# EasyEDA Pro project ProPrj_Y车Y形板_2025-09-30.epro, schematic 转线板
Board Name: ART屏幕接线板; Create Date: 2025-05-24; Page Name: P1; Project Name: Y车Y形板; Schematic Name: 转线板; Update Date: 2025-05-31; Company: 嘉立创EDA; Page Size: A4; Version: V1.0
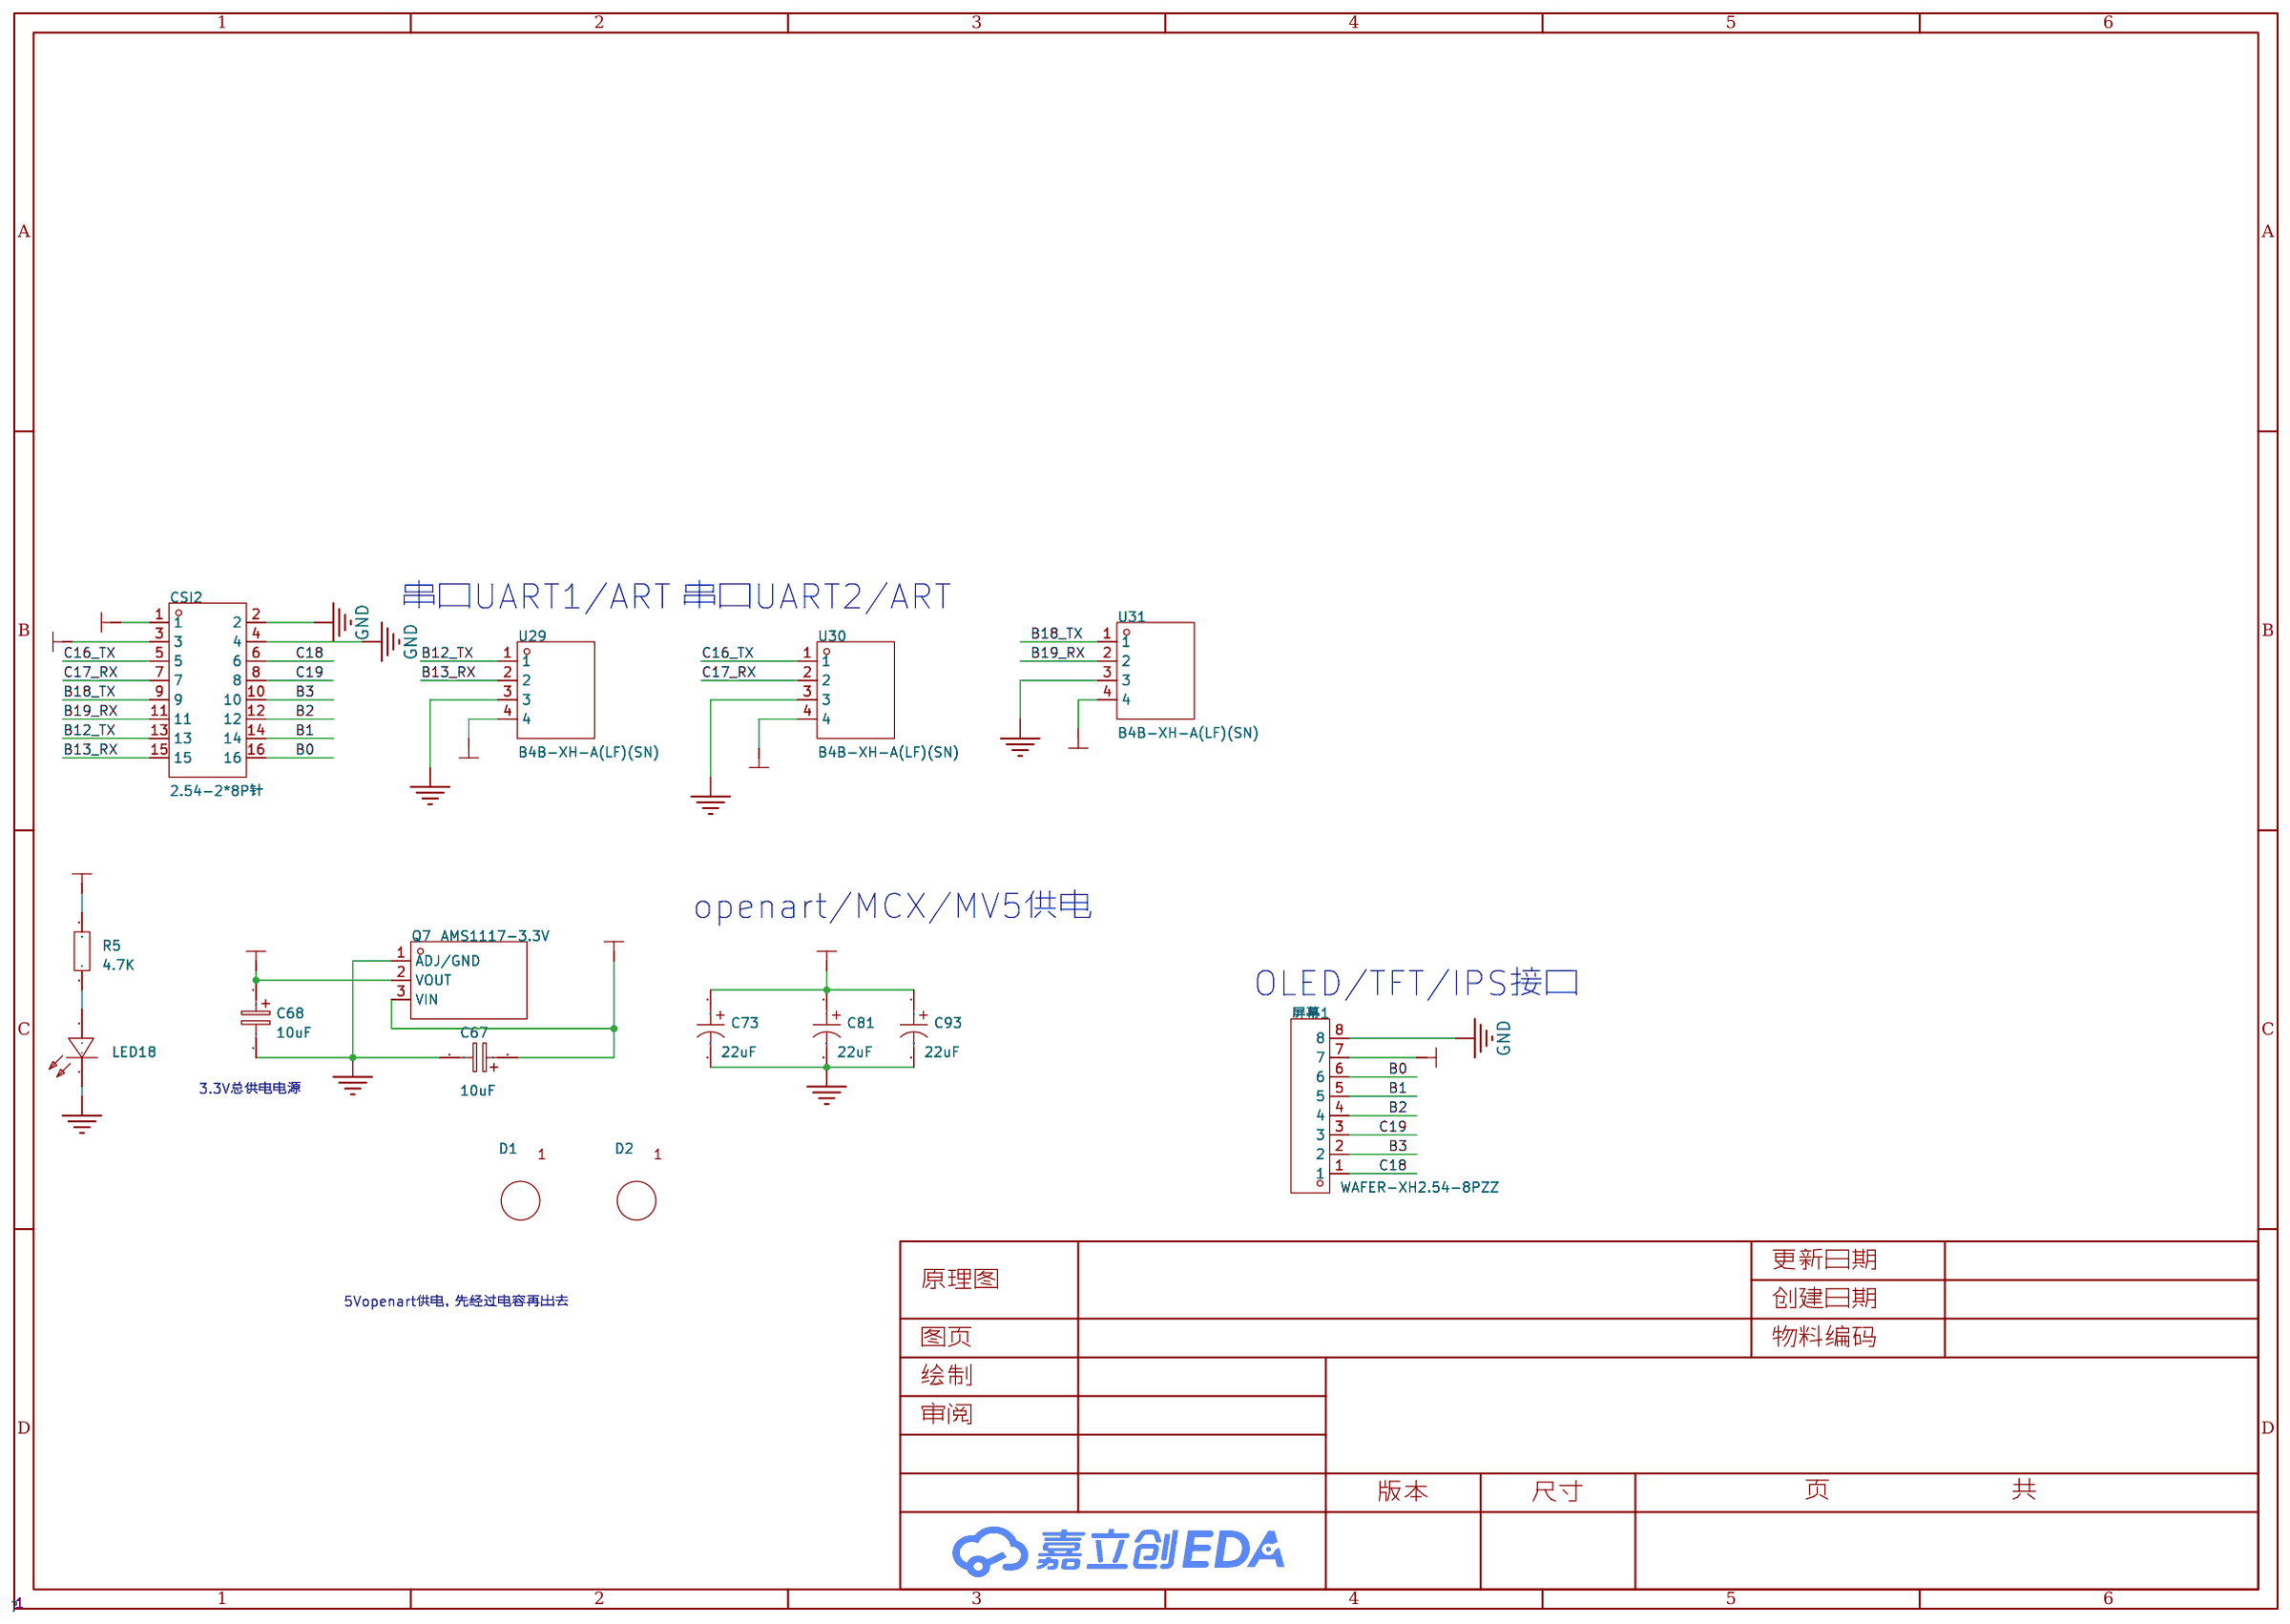
[diagram p5: schematic sheet]

## Parts
C67  10uF  [CAP-SMD_L3.5-W2.8-R-RD]
C68  10uF  [CAP-SMD_L3.5-W2.8-R-RD]
C73  22uF  [CAP-SMD_L3.2-W1.6]
C81  22uF  [CAP-SMD_L3.2-W1.6]
C93  22uF  [CAP-SMD_L3.2-W1.6]
CSI2  2.54-2*8P针  [HDR-TH_16P-P2.54-V-M-R2-C8-S2.54]
D1  -  [M3]
D2  -  [M3]
LED18  NCD0805R1  [LED0805-RD]
Q7  AMS1117-3.3V  [AMS1117]
R5  4.7K  [R0805]
U29  B4B-XH-A(LF)(SN)  [CONN-TH_B4B-XH-A-LF-SN]
U30  B4B-XH-A(LF)(SN)  [CONN-TH_B4B-XH-A-LF-SN]
U31  B4B-XH-A(LF)(SN)  [CONN-TH_B4B-XH-A-LF-SN]
屏幕1  WAFER-XH2.54-8PZZ  [CONN-TH_8P-P2.50-XH2.54-8P]

## Library data of the parts
C67 C68 = CA45-B-16V-10μF-K: 容值:10uF;精度:±10%;额定电压:16V;等效串联电阻:2.8Ω@100kHz;; LCSC Part Name: 10uF ±10% 16V; Supplier Part: C503899; Manufacturer: TORCH(火炬); Supplier Footprint: CASE-B-3528; JLCPCB Part Class: 扩展库; Datasheet: https://atta.szlcsc.com/upload/public/pdf/source/20200527/C503899_E68A547A52C2BA3860090FD06476D5DC.pdf; Supplier: LCSC; Tolerance: ±10%; Rated Voltage: 16V; Equivalent Series Resistance(ESR): 2.8Ω@100kHz; Operating Temperature: -55℃~+125℃
C73 C81 C93 = CA45-A-16V-22uF-K: 容值:22uF;精度:±10%;额定电压:16V;等效串联电阻:6Ω@100kHz;; LCSC Part Name: 22uF ±10% 16V; Supplier Part: C782264; Manufacturer: CEC(振华新云); Supplier Footprint: CASE-A-3216; JLCPCB Part Class: 扩展库; Datasheet: https://atta.szlcsc.com/upload/public/pdf/source/20200909/C782264_D6D9C4EF3B25E81633C26A9294FBB820.pdf; Supplier: LCSC; Tolerance: ±10%; Rated Voltage: 16V; Equivalent Series Resistance(ESR): 6Ω@100kHz; Operating Temperature: -55℃~+125℃
CSI2 = 2.54-2*8P针_C779499: 圆针/方针:-;额定电流:-;额定电压:-;配合针长度:-;塑高:-;触头材质:-;; LCSC Part Name: 双排直插 2*8排针 2.54mm; Supplier Part: C779499; Manufacturer: BOOMELE(博穆精密); Supplier Footprint: 插件,P=2.54mm; JLCPCB Part Class: 扩展库; Datasheet: https://atta.szlcsc.com/upload/public/pdf/source/20221201/C605E3BE9C0F7226363017EFD1BDE852.pdf; Supplier: LCSC
D1 D2 = 定位孔1
LED18 = NCD0805R1: 发光颜色:红灯;; LCSC Part Name: 红灯; Supplier Part: C84256; Manufacturer: 国星光电; Supplier Footprint: 0805; JLCPCB Part Class: Basic Part; Datasheet: https://atta.szlcsc.com/upload/public/pdf/source/20200820/C84256_F0A75A43B3EAD75808600A0514C76B99.pdf; Supplier: LCSC; Emitted Color: 红灯
Q7 = AMS1117-3.3V_C5120796: 输出类型:固定;最大输入电压:18V;输出电压:3.3V;最大输出电流:1A;输出极性:正极;; LCSC Part Name: 输入18V 输出3.3V 1A; Supplier Part: C5120796; Manufacturer: MSKSEMI(美森科); Supplier Footprint: SOT-89; JLCPCB Part Class: 扩展库; Datasheet: https://atta.szlcsc.com/upload/public/pdf/source/20231123/6117526697EB8BF6175FDEEBA0877266.pdf; Supplier: LCSC; Output Type: 固定; Maximum Input Voltage: 18V; Output Voltage: 3.3V; MAX Output Current: 1A; Dropout Voltage: 1.4V@(1A); standby current: 12mA; Operating Temperature: 0℃~+125℃; Output Polarity: 正极; Number of Outputs: 1
R5 = Res_0805: Supplier Footprint: 0805
U29-U31 = B4B-XH-A(LF)(SN): 插针结构:1x4P;间距:2.5mm;安装方式:直插;参考系列:XH;总PIN数:4P;排数:1;每排PIN数:4;行距:-;额定电流:3A;触头材质:黄铜;触头镀层:锡;工作温度范围:-25℃~+85℃;; LCSC Part Name: 1x4P 间距:2.5mm 直插 系列:XH; Supplier Part: C144395; Manufacturer: JST; Supplier Footprint: 插件,P=2.5mm; JLCPCB Part Class: 扩展库; Datasheet: https://atta.szlcsc.com/upload/public/pdf/source/20180928/C265283_F9DFEEBDB2CF642B6BDFAB4B77BD2680.pdf; Supplier: LCSC; Pins Structure: 1x4P; Pitch: 2.5mm; Mounting Style: 直插; Reference Series: XH; Number of Pins: 4P; Number of Rows: 1; Number of PINs Per Row: 4; Current Rating (Max): 3A; Contact Material: 黄铜; Contact Plating: 锡; Operating Temperature Range: -25℃~+85℃; Rated Voltage (Max): 250V; Plastic Material: PA66; Flame Retardant Rating: UL94V-0; Supplementary Features: 打K脚; Z-Height of the Board: 7mm; X-Length of Bottom Edge on Board (Spacing Line): 12.4mm; Y-Width of Bottom Edge on Board: 5.75mm
屏幕1 = WAFER-XH2.54-8PZZ: 插针结构:1x8P;间距:2.54mm;安装方式:直插;总PIN数:8P;排数:1;每排PIN数:8;额定电流:2A;工作温度范围:-25℃~+85℃;; LCSC Part Name: XH 2.54mm 1x8P 直插; Supplier Part: C5359636; Manufacturer: XUNPU(讯普); Supplier Footprint: 插件,P=2.54mm; JLCPCB Part Class: 扩展库; Datasheet: https://atta.szlcsc.com/upload/public/pdf/source/20230221/5D6483F9C7001DB87CFCFC787E1DC139.pdf; Supplier: LCSC; Pins Structure: 1x8P; Pitch: 2.54mm; Mounting Style: 直插; Number of Pins: 8P; Number of Rows: 1; Number of PINs Per Row: 8; Current Rating (Max): 2A; Operating Temperature Range: -25℃~+85℃

## Nets
3V3: C68.1 Q7.2(VOUT) 屏幕1.7
GND: C67.2 C68.2 C73.2 C81.2 C93.2 CSI2.2 CSI2.4 LED18.1(-) Q7.1(ADJ/GND) U29.3 U30.3 U31.3 屏幕1.8
VCC5V: C67.1 C73.1 C81.1 C93.1 CSI2.1 CSI2.3 Q7.3(VIN) R5.2 U29.4 U30.4 U31.4
B0: CSI2.16 屏幕1.6
B1: CSI2.14 屏幕1.5
B2: CSI2.12 屏幕1.4
B3: CSI2.10 屏幕1.2
B12_TX: CSI2.13 U29.1
B13_RX: CSI2.15 U29.2
B18_TX: CSI2.9 U31.1
B19_RX: CSI2.11 U31.2
C16_TX: CSI2.5 U30.1
C17_RX: CSI2.7 U30.2
C18: CSI2.6 屏幕1.1
C19: CSI2.8 屏幕1.3
$1N1637: LED18.2(+) R5.1

## Notes on the sheet
- 串口UART1/ART
- 串口UART2/ART
- openart/MCX/MV5供电
- OLED/TFT/IPS接口
- 3.3V总供电电源
- 5Vopenart供电，先经过电容再出去
